# Altium schematic sheet osc_blank.SchDoc
size Letter; SheetNumber: 5; SheetTotal: 9
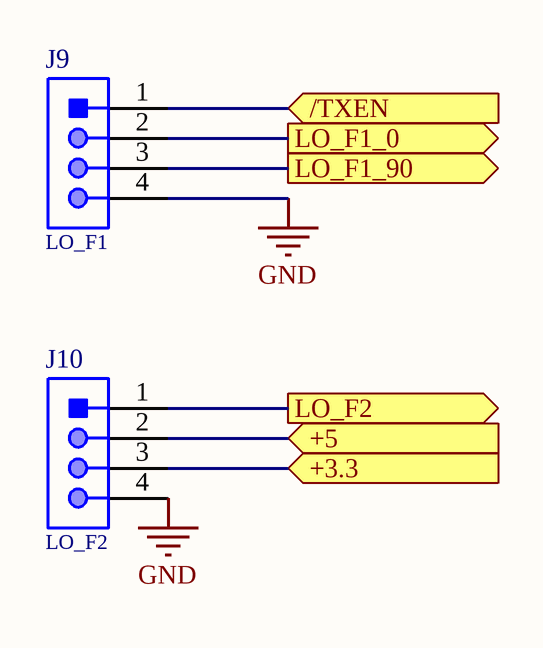
[diagram p0: osc_blank.SchDoc]

## Parts
J9  LO_F1  [61300411121]
J10  LO_F2  [61300411121]

## Ports
+3.3 (in), +5 (in), /TXEN (in), LO_F1_0 (out), LO_F1_90 (out), LO_F2 (out)

## Nets
GND: J9.4 J10.4
+3.3: J10.3 ; port +3.3
+5: J10.2 ; port +5
/TXEN: J9.1 ; port /TXEN
LO_F1_0: J9.2 ; port LO_F1_0
LO_F1_90: J9.3 ; port LO_F1_90
LO_F2: J10.1 ; port LO_F2

## Library data of the parts
J9 J10 = CMP-1502-01064-1: THT Vertical Pin Header WR-PHD, Pitch 2.54 mm, Single Row, 4 pins; Manufacturer: Wurth Elektronik; Withstanding Voltage: 500VAC; Rated Current: 3A; Working Voltage: 250VAC; Pin Number: 4; Gender: Male; Contact Resistance: 20mOhm; Pitch: 2.54mm; Manufacturer URL: http://www.we-online.de; Operating Temperature: -40to105degC; Packaging: Bag; Mounting Technology: THT; Package Reference: 61300411121; Datasheet URL: https://katalog.we-online.de/em/datasheet/6130xx11121.pdf; Publisher: WurthElektronik; Part Number: 61300411121; Row Number: Single; Orientation: Vertical